# Altium project LED_DRIVER.PrjPcb
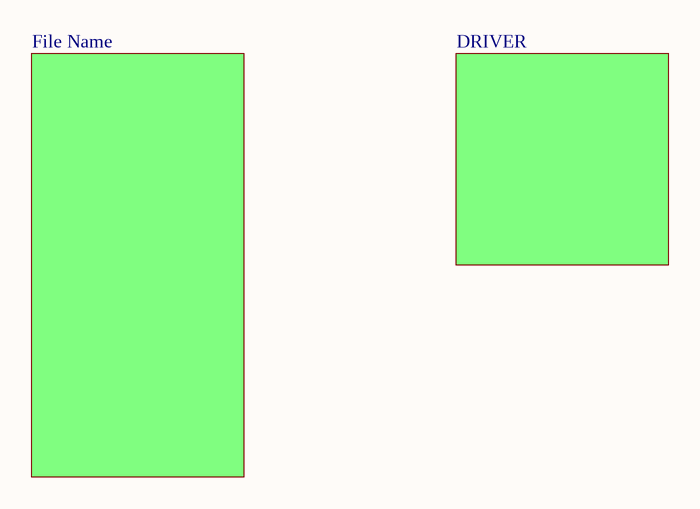
[diagram p0: LED_DRIVER.SchDoc]
2 sheets, 11 parts. Net scope: global (net labels, ports and power ports of the same name join across sheets).
Sheets:
  LED_DRIVER.SchDoc
    DRIVER = DRIVER.SchDoc

## Sheet LED_DRIVER.SchDoc
size A4; SheetNumber: 1; SheetTotal: 2

### Sub-sheets
DRIVER = DRIVER: no entries
MCU = File Name (file not in this document): no entries

## Sheet DRIVER.SchDoc
size A4; SheetNumber: 2; SheetTotal: 2
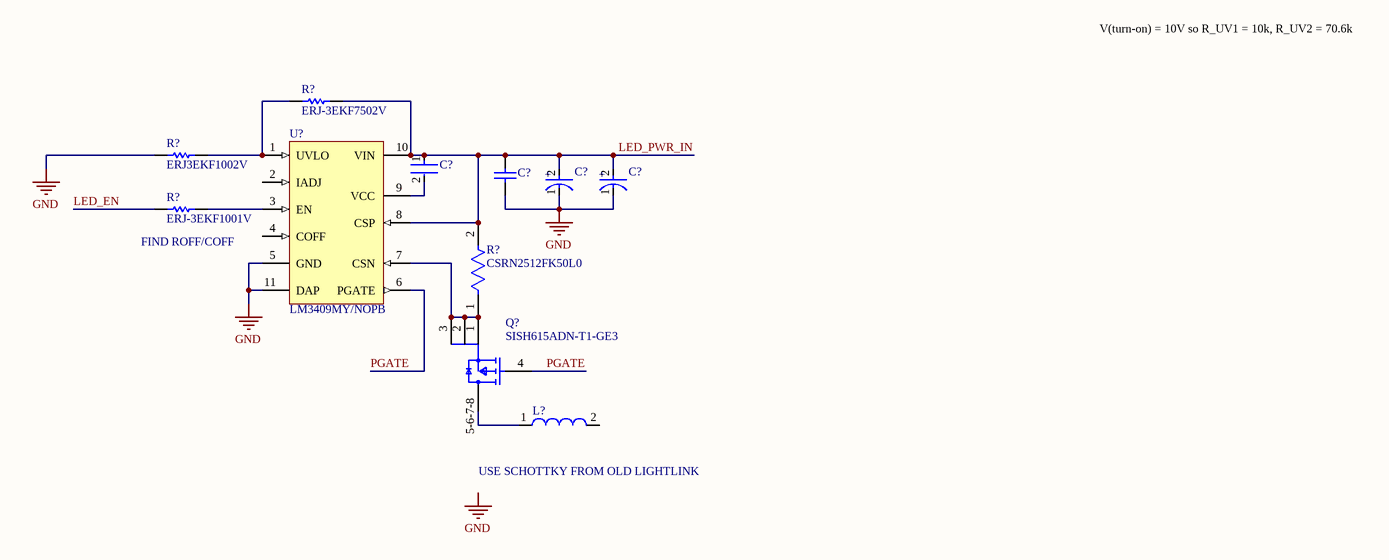
[diagram p1: DRIVER.SchDoc]

### Parts
(Parts that share a designator on the sheet are numbered #1, #2 ... from top to bottom, then left to right.)
C?#1  UMK107AB7105KA-T  [FP-0603-L_1_6_0_15-W_0_8-IPC_C]  (value not drawn)
C?#2  EEHZA1V680XP  [FP-EEH-D8-MFG]  (value not drawn)
C?#3  EEHZA1V680XP  [FP-EEH-D8-MFG]  (value not drawn)
C?#4  CAP 470nF 50V 1812(4532)  [CAPC1812(4532)125_M]  (value not drawn)
L?  74477110  [WE-PD-L]  (value not drawn)
Q?  SISH615ADN-T1-GE3  [SISH615ADN-T1-GE3-Footprint-1]
R?#1  ERJ-3EKF7502V  [RESC1608X55X30NL15T15]
R?#2  ERJ3EKF1002V  [RESC1609X55X30LL15T15]
R?#3  ERJ-3EKF1001V  [RESC1608X55X30LL15T15]
R?#4  CSRN2512FK50L0  [FP-CSRN2512-MFG]
U?  LM3409MY/NOPB  [DGQ0010A_L]

### Nets
GND: C?#2.1(C) C?#3.1(C) C?#4.1 R?#2.1 U?.5(GND) U?.11(DAP)
LED_EN: R?#3.1
LED_PWR_IN: C?#1.1 C?#2.2(A) C?#3.2(A) C?#4.2 R?#1.2 R?#4.2 U?.8(CSP) U?.10(VIN)
PGATE: Q?.4(G) U?.6(PGATE)
NetC?#1_2: C?#1.2 U?.9(VCC)
NetL?_1: L?.1 Q?.5-6-7-8(D)
NetQ?_1: Q?.1(S) Q?.2(S) Q?.3(S) R?#4.1 U?.7(CSN)
NetR?#1_1: R?#1.1 R?#2.2 U?.1(UVLO)
NetR?#3_2: R?#3.2 U?.3(EN)

Not connected (* = marked no-connect by the designer): L? 2; U? 2(IADJ) 4(COFF)

### Notes on the sheet
- (near R?#3) FIND ROFF/COFF
- V(turn-on) = 10V so R_UV1 = 10k, R_UV2 = 70.6k
- (near L?) USE SCHOTTKY FROM OLD LIGHTLINK
- Labels drawn without touching a wire or pin: GND
- (in symbol CMP-05428-001211-1) +

### Library data of the parts
C?#1 = CMP-2000-07531-4: Ceramic Capacitor General Use 1uF ±10% 50V X7R 0603; Series: M; Width: 0.031inch; Mount: Surface Mount; Radiation Hardening: No; Voltage Rating (DC): 50V; Packaging: Tape and Reel; Termination: SMD/SMT; Depth: 0.8mm; Case Code (Metric): 1608; Case Code (Imperial): 0603; Height: 0.8mm; Voltage Rating: 50V; Package Quantity: 1; Halogen Free: Halogen Free; Dielectric: X7R; Min Operating Temperature: -55°C; Length: 1.6mm; Construction: Flat; Tolerance: 10%; Thickness: 0.037inch; Max Operating Temperature: 125°C; Case/Package: 0603; Capacitance: 1uF; RoHS Compliant: Yes
C?#2 C?#3 = CMP-05428-001211-1: Conductive Polymer Hybrid Aluminum Electrolytic Capacitors 68uF ±20% 35V RADIAL SMT 6.3x7.7mm; Leakage Current: 23.8uA; Ripple Current (AC): 2A; Polarity: Polar; Life (Hours): 5000Hour; ESR (Equivalent Series Resistance): 35mR; Lead Diameter: 0.65mm; Termination: SMD/SMT; Case/Package: Radial; Package Quantity: 900; Radiation Hardening: No; Max Operating Temperature: 105°C; Capacitance: 68uF; Voltage Rating: 35V; Number of Pins: 8; Mount: Surface Mount; Technology: HYBRID; Diameter: 6.3mm; Min Operating Temperature: -55°C; Length: 7.7mm; Ratings: AEC-Q200; Height - Seated (Max): 0.315inch; Ripple Current: 2A; Lead Free: Lead Free; Voltage: 35V; Lead Pitch: 1.8mm; Voltage Rating (DC): 35V; REACH SVHC: No SVHC; Material: Polymer; Height: 7.7mm; Tolerance: 20%; Construction: Cylindrical; Packaging: Tape and Reel; Series: ZA
C?#4 = CMP-1040-01539-1: CAP 470nF 50V ±10% 1812 (4532 Metric) Thickness 1.25mm SMD; Tolerance: Â±10%; Case-Metric: 4532; Case-EIA: 1812; Technology: SMT; Max Thickness: 1.25 mm; Value: 470nF; Rated Voltage: 50 V
L? = CMP-0227-00708-1: SMD-Shielded Power Inductor WE-PD, L = 10.0 µH; Inductance: 10.0 ÂµH; ComponentLink2Description: Datasheet; DatasheetVersion: ver 7, Sep-2006; PackageVersion: 2006; ComponentLink1URL: http://www.we-online.com; ComponentLink1Description: Manufacturer Link; ComponentLink2URL: http://www.we-online.de/katalog/media/pdf/74477110.pdf; PackageDescription: SMD Inductor, 2-Leads, Body 12.0 x 12.0 mm; PackageReference: WE-PD-L
Q? = CMP-013-00036-2: Trans MOSFET P-CH 20V 22.1A 8-Pin PowerPAK 1212 EP T/R
R?#1 = CMP-2000-00637-1: Manufacturer: Panasonic; Part Number: ERJ-3EKF7502V
R?#2 = CMP-1012-00623-3: Chip Resistor, 10 KOhm, +/- 1%, 0.1 W, -55 to 155 degC, 0603 (1608 Metric), RoHS, Tape and Reel; Manufacturer: Panasonic; Voltage Rating: 75V; Case\/Package: 0603; Power Rating: 100mW; Resistance: 10KOhm; Temperature Coefficient: 100ppm\/degreesC; Number of Pins: 2; Package Reference: 603; Depth: 0.8mm; Mount: SurfaceMount; Package Description: 2-Pin Surface Mount Device, Body 1.6 x 0.85 mm; Datasheet Version: 02/2017; Length: 1.6mm; Lead Free: LeadFree; Height: 0.45mm; Number of Terminations: 2; Max Power Dissipation: 100mW; Min Operating Temperature: -55degC; Datasheet URL: https://industrial.panasonic.com/cdbs/www-data/pdf/RDA0000/AOA0000C304.pdf; Termination: SMD/SMT; Case Code (Metric): 1608; Case Code (Imperial): 0603; Tolerance: 1%; Max Operating Temperature: 155degC; RoHSCompliant: true; Voltage Rating (DC): 75V; Radiation Hardening: No; Packaging: TapeandReel; Composition: ThickFilm; Mounting Technology: SurfaceMount; Manufacturer URL: http://www.panasonic.com/; Width: 0.031inch; REACH SVHC: NoSVHC; Contact Plating: Tin; Military Standard: Not; Package Quantity: 1
R?#3 = CMP-2000-00180-1: Manufacturer: Panasonic; Part Number: ERJ-3EKF1001V
R?#4 = CMP-26527-003567-1: Res Thick Film 2512 50mΩ 1% 2W ±200ppm/°C Molded SMD Plastic T/R; Resistance: 50mR; Construction: Rectangular; Case Code (Metric): 6432; Length: 0.25inch; Contact Plating: Tin; Lead Free: Lead Free; Case/Package: 2512; Min Operating Temperature: -55°C; Power Rating: 2W; Military Standard: Not; Depth: 3.15mm; Case Code (Imperial): 2512; Max Operating Temperature: 155°C; Radiation Hardening: No; Height: 0.028inch; Series: CSRN; Temperature Coefficient: 200ppm/°C; Tolerance: 1%; Max Power Dissipation: 2W; Packaging: Tape and Reel; Number of Terminations: 2; Width: 0.124inch; Resistor Type: Thick Film; RoHS Compliant: Yes; Size Code: 2512; Mount: Surface Mount
U? = CMP-0063-01389-3: PFET Buck Controller for High Power LED Drives, 10-pin eMSOP, Pb-Free; Manufacturer: Texas Instruments; PowerWise: Y; PackageTopMarking: ZXTT*SXFB; CompType: MiscPower; PinCount: 10; ComponentLink1URL: http://www.ti.com/general/docs/lit/getliterature.tsp?genericPartNumber=LM3409&fileType=pdf; PackageReference: DGQ0010A; RoHS: Y; ComponentLink1Description: Datasheet URL; Code_JEDEC: MO-187-BAT; PackageDescription: Molded Mini-SO, Exposed Pad .118 x .118 x .034in Body, 10 Lead, .0197in Pitch